# Altium schematic sheet RC_Filter.SchDoc
size A4; SheetNumber: 4; SheetTotal: 6
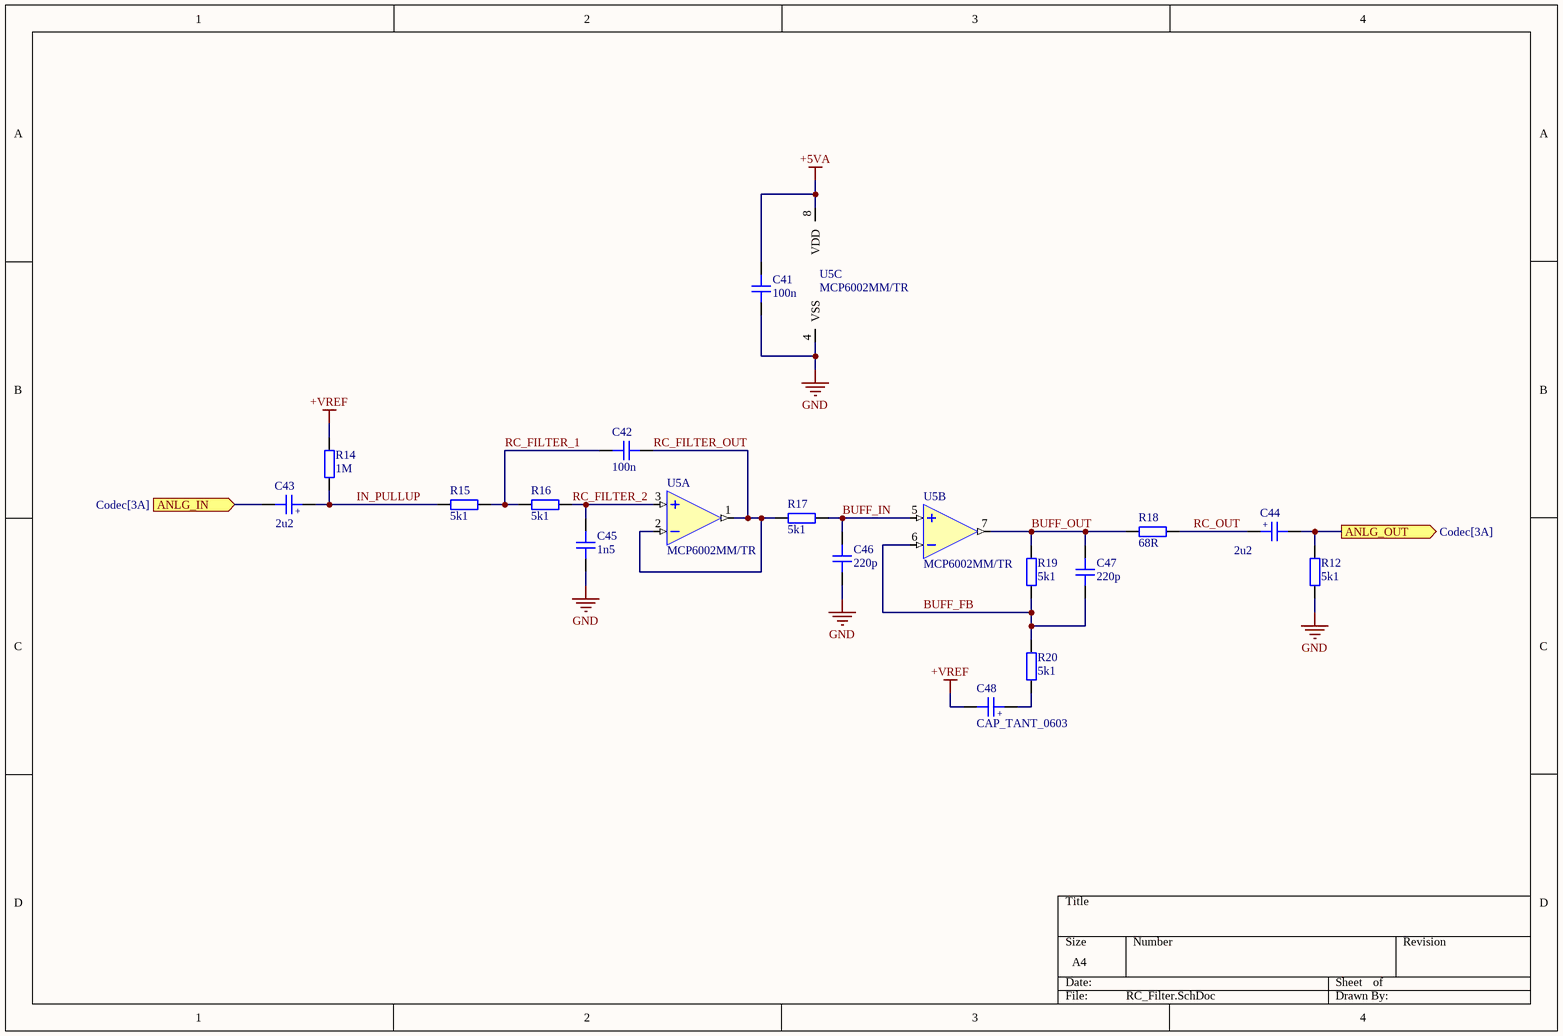
[diagram p0: RC_Filter.SchDoc]

## Parts
C41  100n  [CAP_0603]
C42  100n  [CAP_0603]
C43  2u2  [CAP_TANT_0603]
C44  2u2  [CAP_TANT_0603]
C45  1n5  [CAP_0603]
C46  220p  [CAP_0603]
C47  220p  [CAP_0603]
C48  CAP_TANT_0603  [CAP_TANT_0603]
R12  5k1  [RES_0603]
R14  1M  [RES_0603]
R15  5k1  [RES_0603]
R16  5k1  [RES_0603]
R17  5k1  [RES_0603]
R18  68R  [RES_0603]
R19  5k1  [RES_0603]
R20  5k1  [RES_0603]
U5  MCP6002MM/TR  [MSOP8]  (parts A,B,C of 3)

## Ports
ANLG_IN (in, see Codec[3A]), ANLG_OUT (out, see Codec[3A])

## Nets
+5VA: C41.2 U5.8(VDD)
+VREF: C48.K R14.2
GND: C41.1 C45.2 C46.2 R12.2 U5.4(VSS)
ANLG_IN: C43.K ; port ANLG_IN
ANLG_OUT: C44.K R12.1 ; port ANLG_OUT
BUFF_FB: C47.2 R19.2 R20.1 U5.6(2IN-)
BUFF_IN: C46.1 R17.1 U5.5(2IN+)
BUFF_OUT: C47.1 R18.2 R19.1 U5.7(2OUT)
IN_PULLUP: C43.A R14.1 R15.2
RC_FILTER_1: C42.1 R15.1 R16.2
RC_FILTER_2: C45.1 R16.1 U5.3(1IN+)
RC_FILTER_OUT: C42.2 R17.2 U5.1(1OUT) U5.2(1IN-)
RC_OUT: C44.A R18.1
NetC48_A: C48.A R20.2

## Notes on the sheet
- (in symbol CAP_TANT_0603) +

## Library data of the parts
C41 C42 C45-C47 = CAP_0603: Capacitor SMD 0603; Manufacturer: *; Manufacturer Part Number: *; Distributor Link: *; LCSC: *; Rating: *; Dielectric: *
C43 C44 C48 = CAP_TANT_0603: Capacitor SMD Tantalum 0603; Manufacturer: *; Manufacturer Part Number: *; Distributor Link: *; LCSC: *
R12 R14-R20 = RES_0603: Resistor SMD 0603; Manufacturer: *; Manufacturer Part Number: *; Distributor Link: *; LCSC: *
U5 = MCP6002MM/TR: 1MHZ CMOS Rail-to-Rail IO Opamp with RF Filter MSOP-8; Manufacturer: HGSEMI; Manufacturer Part Number: MCP6002MM/TR; LCSC: C910874